# Altium schematic sheet Sensor.SchDoc
size A4
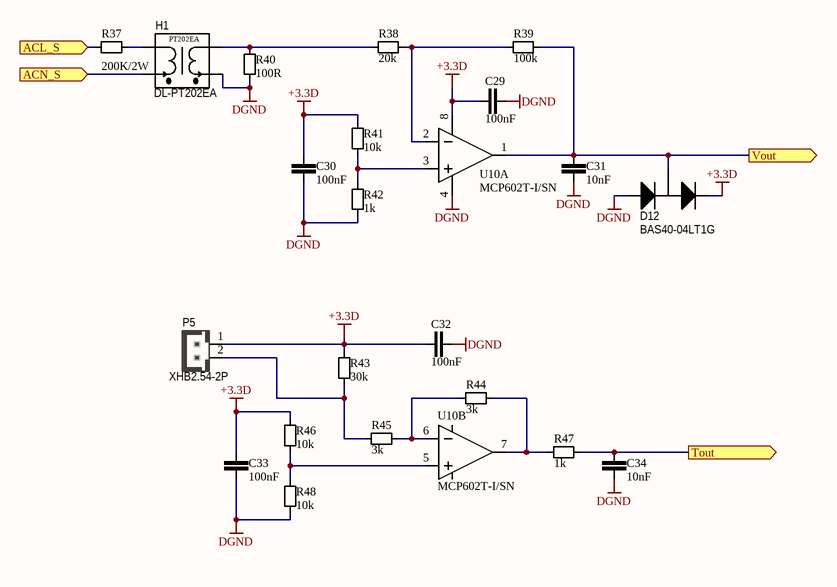
[diagram p0: Sensor.SchDoc]

## Parts
C29  value 100nF  [0603-C]  (hidden comment: Cap)
C30  value 100nF  [0603-C]  (hidden comment: Cap)
C31  value 10nF  [0603-C]  (hidden comment: Cap)
C32  value 100nF  [0603-C]  (hidden comment: Cap)
C33  value 100nF  [0603-C]  (hidden comment: Cap)
C34  value 10nF  [0603-C]  (hidden comment: Cap)
D12  BAS40-04LT1G  [SOT-23_N]
H1  DL-PT202EA  [DL-PT202EA]
P5  XHB2.54-2P  [XH-2]
R37  value 200K/2W  [AXIAL-5mm]  (hidden comment: Res)
R38  value 20k  [0603-R]  (hidden comment: Res)
R39  value 100k  [0603-R]  (hidden comment: Res)
R40  value 100R  [0603-R]  (hidden comment: Res)
R41  value 10k  [0603-R]  (hidden comment: Res)
R42  value 1k  [0603-R]  (hidden comment: Res)
R43  value 30k  [0603-R]  (hidden comment: Res)
R44  value 3k  [0603-R]  (hidden comment: Res)
R45  value 3k  [0603-R]  (hidden comment: Res)
R46  value 10k  [0603-R]  (hidden comment: Res)
R47  value 1k  [0603-R]  (hidden comment: Res)
R48  value 10k  [0603-R]  (hidden comment: Res)
U10  MCP602T-I/SN  [SO-8_N]  (parts A,B of 2)

## Ports
ACL_S (in), ACN_S (in), Tout (out), Vout (out)

## Nets
+3.3D: C29.1 C30.1 C32.1 C33.1 D12.2(K) P5.1 R41.1 R43.1 R46.1 U10.8
DGND: C29.2 C30.2 C31.2 C32.2 C33.2 C34.2 D12.1(A) H1.4 R40.1 R42.1 R48.2 U10.4
ACL_S: R37.1 ; port ACL_S
ACN_S: H1.1 ; port ACN_S
Tout: C34.1 R47.2 ; port Tout
Vout: C31.1 D12.3(C) R39.2 U10.1 ; port Vout
NetH1_2: H1.2 R37.2
NetH1_3: H1.3 R38.2 R40.2
NetP5_2: P5.2 R43.2 R45.1
NetR38_1: R38.1 R39.1 U10.2
NetR41_2: R41.2 R42.2 U10.3
NetR44_1: R44.1 R45.2 U10.6
NetR44_2: R44.2 R47.1 U10.7
NetR46_2: R46.2 R48.1 U10.5

## Notes on the sheet
- (in symbol H1DZPT202EAX) PT202EA

## Library data of the parts
C29 C30 C32 C33 = C21C100NK1H0: MLCC 100nF 10% 50V X7R 0603; TemperatureRange: -55°C to 150°C; VenderID: MLCC-0603-50V-104K-X7R; Published: 1-Jun-2017; Publisher: GreenBox; MountType: SMT; PackageReference: 0603; Manufacturer: *
C31 C34 = C21C010NK1H0: MLCC 10nF 10% 50V X7R 0603; TemperatureRange: -55°C to 150°C; VenderID: MLCC-0603-50V-103K-X7R; Published: 1-Jun-2017; Publisher: GreenBox; MountType: SMT; PackageReference: 0603; Manufacturer: *
D12 = D742BAS4004O: Dual Series Schottky Barrier Diode BAS40-04LT1G Vrrm 40V If 0.12A Ir 1uA; Manufacturer: ON SEMICONDUCTOR; TemperatureRange: -55 to 150°C; MountType: SMT; PackageReference: SOT-23; Published: 1-Jun-2017; Publisher: GreenBox; VenderID: BAS40-04LT1G
H1 = H1DZPT202EAX: Voltage Transformer DL-PT202EA 2mA/2mA 0.1; Manufacturer: 南京向上电子科技有限公司; TemperatureRange: -35 to 70°C; MountType: DIP; PackageReference: DL-PT202EA; Published: 1-Jun-2017; Publisher: GreenBox; VenderID: DL-PT202EA
P5 = P6DX02Z25400: Header XHB2.54-2P 2.54mm; TemperatureRange: -25 to 85°C; Manufacturer: *; MountType: DIP; PackageReference: XH2.54-2P; Published: 1-Jun-2017; Publisher: GreenBox; VenderID: XHB2.54-2P
R37 = RMDA200KFGF0: Metal Film Resistor 200KR 1% 2W0 AXIAL 100PPM; TemperatureRange: -55°C to 150°C; VenderID: 200K-2W-1%; Published: 1-Jun-2017; Publisher: GreenBox; MountType: DIP; PackageReference: AXIAL; Manufacturer: *
R38 = R11C020KFBF0: SMD Resistor 20k 1% 1/10W 0603 100PPM; TemperatureRange: -55°C to 150°C; VenderID: RES-0603-20k-1%; Published: 1-Jun-2017; Publisher: GreenBox; MountType: SMT; PackageReference: 0603; Manufacturer: *
R39 = R11C100KFBF0: SMD Resistor 100k 1% 1/10W 0603 100PPM; TemperatureRange: -55°C to 150°C; VenderID: RES-0603-100k-1%; Published: 1-Jun-2017; Publisher: GreenBox; MountType: SMT; PackageReference: 0603; Manufacturer: *
R40 = R11C100RFBF0: SMD Resistor 100R 1% 1/10W 0603 100PPM; TemperatureRange: -55°C to 150°C; VenderID: RES-0603-100R-1%; Published: 1-Jun-2017; Publisher: GreenBox; MountType: SMT; PackageReference: 0603; Manufacturer: *
R41 R46 R48 = R11C010KFBF0: SMD Resistor 10k 1% 1/10W 0603 100PPM; TemperatureRange: -55°C to 150°C; VenderID: RES-0603-10k-1%; Published: 1-Jun-2017; Publisher: GreenBox; MountType: SMT; PackageReference: 0603; Manufacturer: *
R42 R47 = R11C001KFBF0: SMD Resistor 1k 1% 1/10W 0603 100PPM; TemperatureRange: -55°C to 150°C; VenderID: RES-0603-1k-1%; Published: 1-Jun-2017; Publisher: GreenBox; MountType: SMT; PackageReference: 0603; Manufacturer: *
R43 = R11C030KFBF0: SMD Resistor 30k 1% 1/10W 0603 100PPM; TemperatureRange: -55°C to 150°C; VenderID: RES-0603-30k-1%; Published: 1-Jun-2017; Publisher: GreenBox; MountType: SMT; PackageReference: 0603; Manufacturer: *
R44 R45 = R11C003KFBF0: SMD Resistor 3k 1% 1/10W 0603 100PPM; TemperatureRange: -55°C to 150°C; VenderID: RES-0603-3k-1%; Published: 1-Jun-2017; Publisher: GreenBox; MountType: SMT; PackageReference: 0603; Manufacturer: *
U10 = UOS1MCP602IM: Dual Rail To Rail Operational Amplifier MCP602T-I/SN Vcc 2.7V~5.5V Vio 2mV; Manufacturer: MICROCHIP; VenderID: MCP602T-E/SN; TemperatureRange: -40°C to 85°C; Publisher: GreenBox; Published: 1-Jan-2016; PackageReference: SOIC(8); MountType: SMT; PackageDescription: 8-Pin Small Outline Integrated Circuit 1.27 mm Pitch